# Altium schematic sheet ESP.SchDoc: ESP32 PICO D4
size A4; Date: 04/19/2026; CheckedBy: Lanfroid-Nazac Guillaume; Author: Lanfroid-Nazac Guillaume; DrawnBy: DÉRONNE Mathis; Revision: v1.1; SheetNumber: 3; SheetTotal: 7
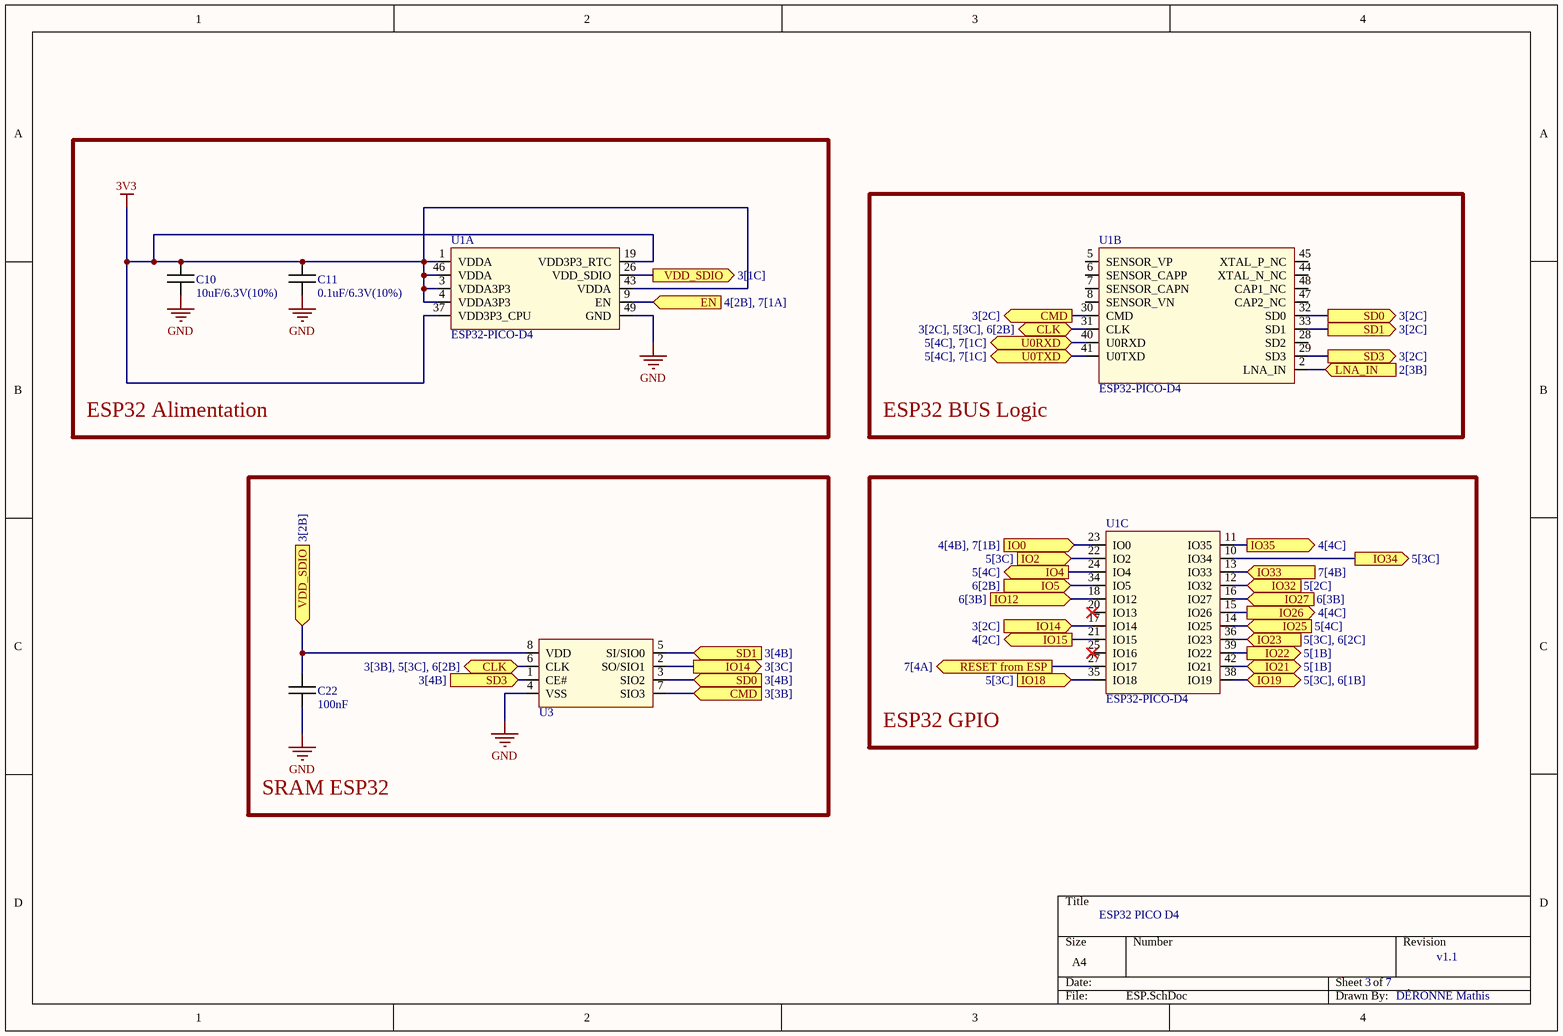
[diagram p0: ESP.SchDoc]

## Parts
C10  10uF/6.3V(10%)  [CAPC1005X06N]
C11  0.1uF/6.3V(10%)  [CAPC1005X06N]
C22  100nF  [CAPC1005X06N]
U1  ESP32-PICO-D4  [PQFN50P700X700X104_HS-49N]  (parts A,B,C of 3)
U3  IS66WVS1M8BLL-104NLI  [SOIC127P600X175-8N]  (value not drawn)

## Blocks framed on the sheet
ESP32 Alimentation: C10 C11 U1
ESP32 BUS Logic: U1
SRAM ESP32: C22 U3
ESP32 GPIO: U1

## Ports
CLK (bidir, see 3[2C], 5[3C], 6[2B]), CLK (bidir, see 3[3B], 5[3C], 6[2B]), CMD (in, see 3[3B]), CMD (out, see 3[2C]), EN (in, see 4[2B], 7[1A]), IO0 (in, see 4[4B], 7[1B]), IO2 (in, see 5[3C]), IO4 (out, see 5[4C]), IO5 (in, see 6[2B]), IO12 (in, see 6[3B]), IO14 (in, see 3[2C]), IO14 (out, see 3[3C]), IO15 (out, see 4[2C]), IO18 (in, see 5[3C]), IO19 (bidir, see 5[3C], 6[1B]), IO21 (bidir, see 5[1B]), IO22 (out, see 5[1B]), IO23 (in, see 5[3C], 6[2C]), IO25 (in, see 5[4C]), IO26 (out, see 4[4C]), IO27 (in, see 6[3B]), IO32 (in, see 5[2C]), IO33 (in, see 7[4B]), IO34 (out, see 5[3C]), IO35 (out, see 4[4C]), LNA_IN (in, see 2[3B]), RESET from ESP (out, see 7[4A]), SD0 (in, see 3[4B]), SD0 (out, see 3[2C]), SD1 (in, see 3[4B]), SD1 (out, see 3[2C]), SD3 (in, see 3[4B]), SD3 (out, see 3[2C]), U0RXD (bidir, see 5[4C], 7[1C]), U0TXD (bidir, see 5[4C], 7[1C]), VDD_SDIO (in, see 3[2B]), VDD_SDIO (out, see 3[1C])

## Nets
3V3: C10.2 C11.2 U1.1(VDDA) U1.3(VDDA3P3) U1.4(VDDA3P3) U1.19(VDD3P3_RTC) U1.37(VDD3P3_CPU) U1.43(VDDA) U1.46(VDDA)
GND: C10.1 C11.1 C22.2 U1.49(GND) U3.4(VSS)
CLK: U1.31(CLK) U3.6(CLK) ; port CLK
CMD: U1.30(CMD) U3.7(SIO3) ; port CMD
EN: U1.9(EN) ; port EN
IO0: U1.23(IO0) ; port IO0
IO2: U1.22(IO2) ; port IO2
IO4: U1.24(IO4) ; port IO4
IO5: U1.34(IO5) ; port IO5
IO12: U1.18(IO12) ; port IO12
IO14: U1.17(IO14) U3.2(SO/SIO1) ; port IO14
IO15: U1.21(IO15) ; port IO15
IO18: U1.35(IO18) ; port IO18
IO19: U1.38(IO19) ; port IO19
IO21: U1.42(IO21) ; port IO21
IO22: U1.39(IO22) ; port IO22
IO23: U1.36(IO23) ; port IO23
IO25: U1.14(IO25) ; port IO25
IO26: U1.15(IO26) ; port IO26
IO27: U1.16(IO27) ; port IO27
IO32: U1.12(IO32) ; port IO32
IO33: U1.13(IO33) ; port IO33
IO34: U1.10(IO34) ; port IO34
IO35: U1.11(IO35) ; port IO35
LNA_IN: U1.2(LNA_IN) ; port LNA_IN
RESET from ESP: U1.27(IO17) ; port RESET from ESP
SD0: U1.32(SD0) U3.3(SIO2) ; port SD0
SD1: U1.33(SD1) U3.5(SI/SIO0) ; port SD1
SD3: U1.29(SD3) U3.1(CE#) ; port SD3
U0RXD: U1.40(U0RXD) ; port U0RXD
U0TXD: U1.41(U0TXD) ; port U0TXD
VDD_SDIO: C22.1 U1.26(VDD_SDIO) U3.8(VDD) ; port VDD_SDIO

Not connected (* = marked no-connect by the designer): U1 5(SENSOR_VP) 6(SENSOR_CAPP) 7(SENSOR_CAPN) 8(SENSOR_VN) 20(IO13)* 25(IO16)* 28(SD2) 44(XTAL_N_NC) 45(XTAL_P_NC) 47(CAP2_NC) 48(CAP1_NC)

## Notes on the sheet
- 3
- 7

## Library data of the parts
C10 C11 C22 = Capacitor
U1 = ESP32: Système RF sur puce - SoC SIP module ESP32 with 4MByte Flash, Dual Core MCU, Wi-Fi & Bluetooth Combo, LGA48-pin, 7*7mm; Manufacturer 1: Espressif Systems; Supplier 1: Digi-Key; Supplier Part Number 1: 1904-1029-1-ND; Manufacturer Part Number 1: ESP32-PICO-D4
U3 = SRAM: SRAM 8Mb, SerialRAM, 2.7V-3.6V, 104MHz, 8 pin SOIC 150 mil, RoHS; Manufacturer 1: ISSI; Supplier 1: Digi-Key; Supplier Part Number 1: 706-IS66WVS1M8BLL-104NLI-ND; Manufactuer Part Number 1: IS66WVS1M8BLL-104NLI